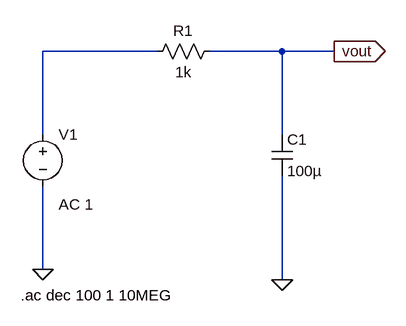
[diagram p0: schematic Draft1.asc]
Draft1.asc, the LTspice schematic file:
Version 4
SHEET 1 880 680
WIRE 144 32 -32 32
WIRE 336 32 224 32
WIRE 416 32 336 32
WIRE -32 160 -32 32
WIRE 336 160 336 32
WIRE -32 368 -32 240
WIRE 336 384 336 224
FLAG -32 368 0
FLAG 336 384 0
FLAG 416 32 vout
IOPIN 416 32 Out
SYMBOL voltage -32 144 R0
WINDOW 123 24 124 Left 2
WINDOW 39 0 0 Left 2
SYMATTR InstName V1
SYMATTR Value ""
SYMATTR Value2 AC 1
SYMBOL res 240 16 R90
WINDOW 0 0 56 VBottom 2
WINDOW 3 32 56 VTop 2
SYMATTR InstName R1
SYMATTR Value 1k
SYMBOL cap 320 160 R0
SYMATTR InstName C1
SYMATTR Value 100µ
TEXT -66 408 Left 2 !.ac dec 100 1 10MEG

The netlist it stands for:
* Draft1.asc
V1 N001 0 AC 1
R1 vout N001 1k
C1 vout 0 100µ
.ac dec 100 1 10MEG
.backanno
.end